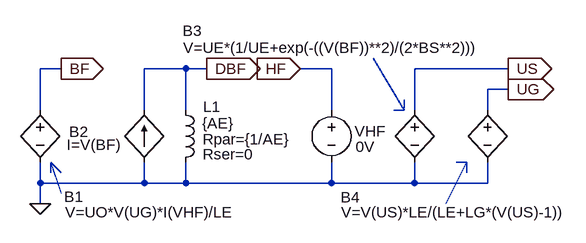
[diagram p0: schematic core.asc]
core.asc, the LTspice schematic file:
Version 4
SHEET 1 2328 820
WIRE 896 176 864 176
WIRE 1088 176 1024 176
WIRE 1120 176 1088 176
WIRE 1312 176 1264 176
WIRE 1584 176 1440 176
WIRE 1584 208 1552 208
WIRE 864 240 864 176
WIRE 1024 240 1024 176
WIRE 1088 240 1088 176
WIRE 1312 240 1312 176
WIRE 1440 240 1440 176
WIRE 1552 240 1552 208
WIRE 864 352 864 320
WIRE 1024 352 1024 320
WIRE 1024 352 864 352
WIRE 1088 352 1088 320
WIRE 1088 352 1024 352
WIRE 1312 352 1312 320
WIRE 1312 352 1088 352
WIRE 1440 352 1440 320
WIRE 1440 352 1312 352
WIRE 1552 352 1552 320
WIRE 1552 352 1440 352
WIRE 864 384 864 352
FLAG 1584 176 US
IOPIN 1584 176 Out
FLAG 896 176 BF
IOPIN 896 176 Out
FLAG 864 384 0
FLAG 1264 176 HF
IOPIN 1264 176 In
FLAG 1120 176 DBF
IOPIN 1120 176 Out
FLAG 1584 208 UG
IOPIN 1584 208 Out
SYMBOL bv 1440 224 R0
WINDOW 0 -357 -106 Left 0
WINDOW 3 -356 -80 Left 0
SYMATTR InstName B3
SYMATTR Value V=UE*(1/UE+exp(-((V(BF))**2)/(2*BS**2)))
SYMBOL bv 864 224 R0
WINDOW 0 37 149 Left 0
WINDOW 3 38 173 Left 0
SYMATTR InstName B1
SYMATTR Value V=UO*V(UG)*I(VHF)/LE
SYMBOL voltage 1312 224 R0
WINDOW 0 36 48 Left 0
WINDOW 3 37 72 Left 0
WINDOW 123 0 0 Left 0
WINDOW 39 0 0 Left 0
SYMATTR InstName VHF
SYMATTR Value 0V
SYMBOL bi 1024 320 R180
WINDOW 0 86 47 Left 0
WINDOW 3 35 27 Left 0
SYMATTR InstName B2
SYMATTR Value I=V(BF)
SYMBOL ind 1072 224 R0
WINDOW 0 43 11 Left 0
WINDOW 3 41 36 Left 0
WINDOW 39 42 61 Left 0
WINDOW 40 42 84 Left 0
SYMATTR InstName L1
SYMATTR Value {AE}
SYMATTR SpiceLine Rpar={1/AE}
SYMATTR SpiceLine2 Rser=0
SYMBOL bv 1552 224 R0
WINDOW 0 -226 150 Left 0
WINDOW 3 -225 173 Left 0
SYMATTR InstName B4
SYMATTR Value V=V(US)*LE/(LE+LG*(V(US)-1))
LINE Normal 1424 240 1376 160
LINE Normal 1424 224 1424 240
LINE Normal 1408 240 1424 240
LINE Normal 880 320 896 368
LINE Normal 896 336 880 320
LINE Normal 880 336 880 320
LINE Normal 880 336 880 336
LINE Normal 1520 320 1488 384
LINE Normal 1520 336 1520 320
LINE Normal 1504 320 1520 320

The netlist it stands for:
* core.asc
B3 US 0 V=UE*(1/UE+exp(-((V(BF))**2)/(2*BS**2)))
B1 BF 0 V=UO*V(UG)*I(VHF)/LE
VHF HF 0 0V
B2 0 DBF I=V(BF)
L1 DBF 0 {AE} Rpar={1/AE} Rser=0
B4 UG 0 V=V(US)*LE/(LE+LG*(V(US)-1))
.backanno
.end